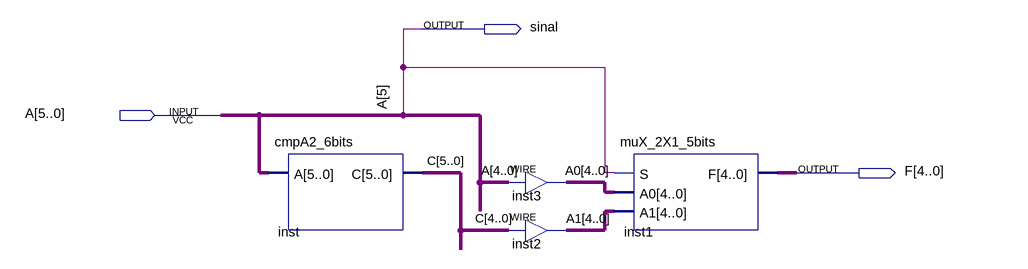
[diagram p0: schematic sheet]
// Quartus schematic descomp_6bits.bdf as structural Verilog: 4 symbols, 3 pins
module descomp_6bits (
  input  [5:0] A,
  output sinal,
  output [4:0] F
);

  wire [4:0] A0, A1;
  wire [5:0] C;

  cmpA2_6bits inst (.A(A), .C(C));
  assign A0 = A[4:0];  // WIRE inst3
  assign A1 = C[4:0];  // WIRE inst2
  muX_2X1_5bits inst1 (.S(A[5]), .A0(A0), .A1(A1), .F(F));

  assign sinal = A[5];
endmodule
